# Altium project FlyControl.PrjPCB
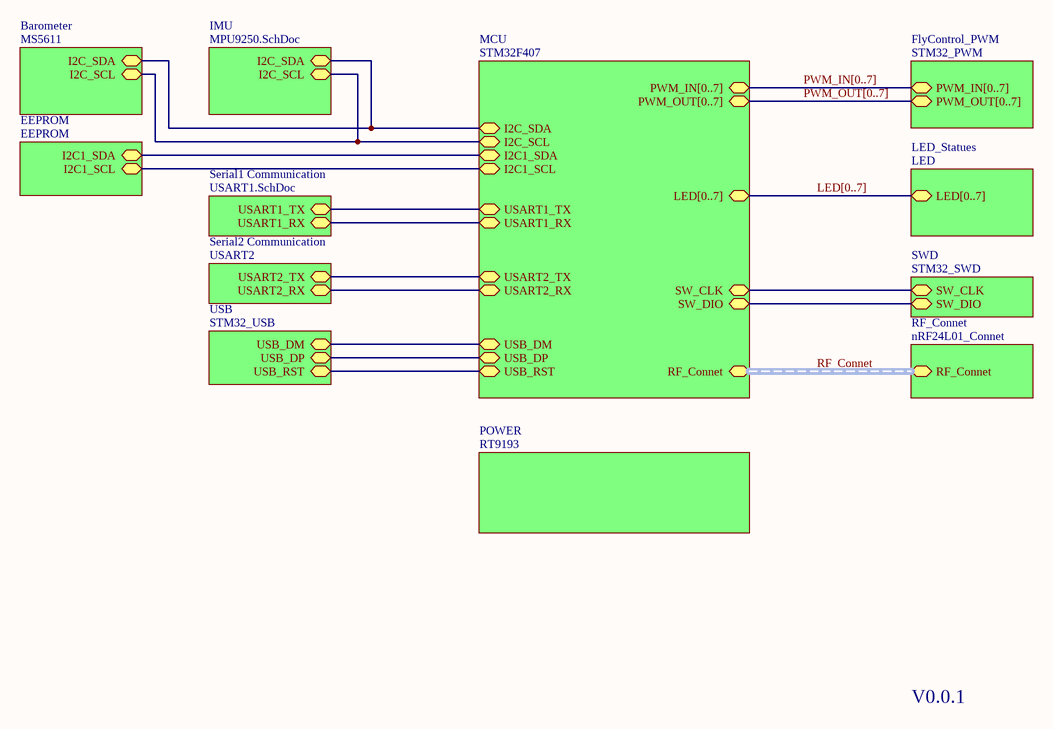
[diagram p0: MAIN.SchDoc]
13 sheets, 74 parts. Net scope: hierarchical (ports join the sheet entries above them; power ports are global).
Board file: FlyControl.PcbDoc
Sheets:
  MAIN.SchDoc
    MCU = STM32F407.SchDoc
    SWD = STM32_SWD.SchDoc
    FlyControl_PWM = STM32_PWM.SchDoc
    IMU = MPU9250.SchDoc
    Barometer = MS5611.SchDoc
    POWER = RT9193.SchDoc
    Serial1 Communication = USART1.SchDoc
    USB = STM32_USB.SchDoc
    Serial2 Communication = USART2.SchDoc
    LED_Statues = LED.SchDoc
    RF_Connet = nRF24L01_Connet.SchDoc
    EEPROM = EEPROM.SchDoc

## Sheet MAIN.SchDoc
size A4

### Sub-sheets
Barometer = MS5611: I2C_SDA, I2C_SCL
EEPROM = EEPROM: I2C1_SDA, I2C1_SCL
FlyControl_PWM = STM32_PWM: PWM_IN[0..7], PWM_OUT[0..7]
IMU = MPU9250.SchDoc: I2C_SDA, I2C_SCL
LED_Statues = LED: LED[0..7]
MCU = STM32F407: PWM_IN[0..7], PWM_OUT[0..7], I2C_SDA, I2C_SCL, LED[0..7], SW_CLK, SW_DIO, USART1_RX, USART1_TX, USART2_RX, USART2_TX, USB_DM, USB_DP, USB_RST, RF_Connet (harness NRF), I2C1_SDA, I2C1_SCL
POWER = RT9193: no entries
RF_Connet = nRF24L01_Connet: RF_Connet (harness NRF)
Serial1 Communication = USART1.SchDoc: USART1_TX, USART1_RX
Serial2 Communication = USART2: USART2_TX, USART2_RX
SWD = STM32_SWD: SW_DIO, SW_CLK
USB = STM32_USB: USB_DM, USB_DP, USB_RST

### Nets
I2C1_SCL: sheet MCU/I2C1_SCL, sheet EEPROM/I2C1_SCL
I2C1_SDA: sheet MCU/I2C1_SDA, sheet EEPROM/I2C1_SDA
I2C_SCL: sheet MCU/I2C_SCL, sheet IMU/I2C_SCL, sheet Barometer/I2C_SCL
I2C_SDA: sheet MCU/I2C_SDA, sheet IMU/I2C_SDA, sheet Barometer/I2C_SDA
SW_CLK: sheet MCU/SW_CLK, sheet SWD/SW_CLK
SW_DIO: sheet MCU/SW_DIO, sheet SWD/SW_DIO
USART1_RX: sheet MCU/USART1_RX, sheet Serial1 Communication/USART1_RX
USART1_TX: sheet MCU/USART1_TX, sheet Serial1 Communication/USART1_TX
USART2_RX: sheet MCU/USART2_RX, sheet Serial2 Communication/USART2_RX
USART2_TX: sheet MCU/USART2_TX, sheet Serial2 Communication/USART2_TX
USB_DM: sheet MCU/USB_DM, sheet USB/USB_DM
USB_DP: sheet MCU/USB_DP, sheet USB/USB_DP
USB_RST: sheet MCU/USB_RST, sheet USB/USB_RST

### Buses and harness runs
bus LED[0..7] = sheet LED_Statues/LED[0..7] = sheet MCU/LED[0..7]
bus PWM_IN[0..7] = sheet FlyControl_PWM/PWM_IN[0..7] = sheet MCU/PWM_IN[0..7]
bus PWM_OUT[0..7] = sheet FlyControl_PWM/PWM_OUT[0..7] = sheet MCU/PWM_OUT[0..7]
harness RF_Connet = sheet MCU/RF_Connet = sheet RF_Connet/RF_Connet

### Notes on the sheet
- V0.0.1

## Sheet STM32F407.SchDoc
size A3
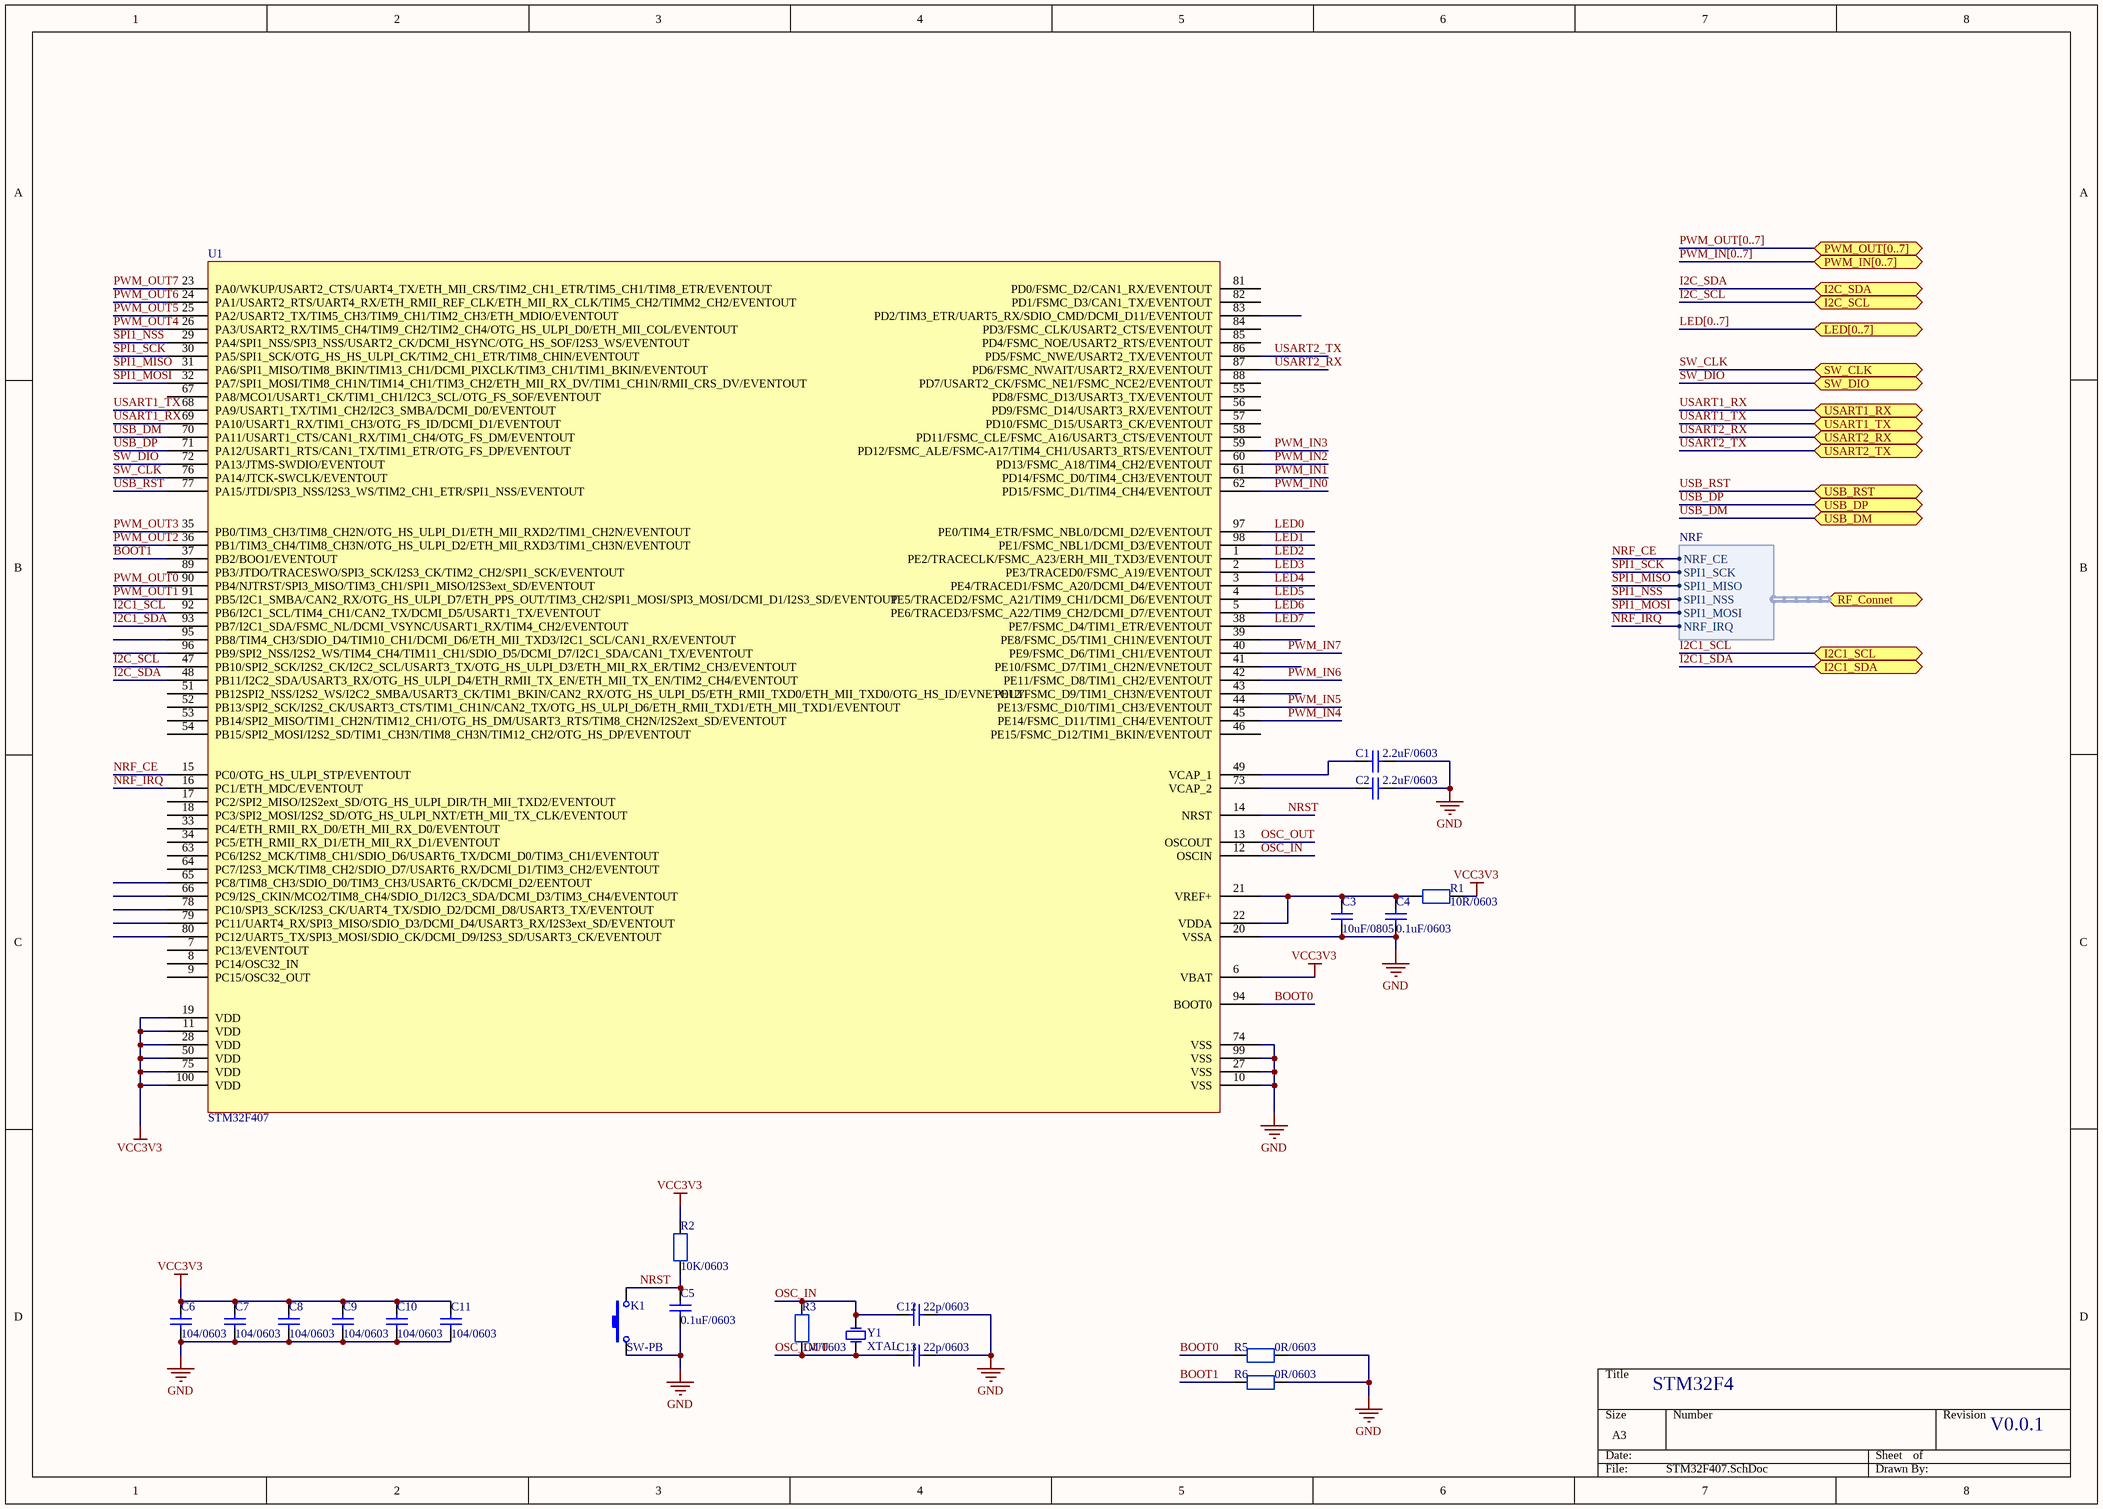
[diagram p1: STM32F407.SchDoc]

### Parts
C1  2.2uF/0603  [C0603]
C2  2.2uF/0603  [C0603]
C3  10uF/0805  [C0805]
C4  0.1uF/0603  [C0603]
C5  0.1uF/0603  [C0603]
C6  104/0603  [C0603]
C7  104/0603  [C0603]
C8  104/0603  [C0603]
C9  104/0603  [C0603]
C10  104/0603  [C0603]
C11  104/0603  [C0603]
C12  22p/0603  [C0603]
C13  22p/0603  [C0603]
K1  SW-PB  [SW-PB-A1]
R1  10R/0603  [R0603]
R2  10K/0603  [R0603]
R3  1M/0603  [R0603]
R5  0R/0603  [R0603]
R6  0R/0603  [R0402]
U1  STM32F407  [LQFP100-N]
Y1  XTAL  [XTAL-3225]

### Ports
I2C1_SCL, I2C1_SDA, I2C_SCL, I2C_SDA, LED[0..7], PWM_IN[0..7], PWM_OUT[0..7], RF_Connet (harness NRF), SW_CLK, SW_DIO, USART1_RX, USART1_TX, USART2_RX, USART2_TX, USB_DM, USB_DP, USB_RST

### Harnesses
NRF: NRF_CE, SPI1_SCK, SPI1_MISO, SPI1_NSS, SPI1_MOSI, NRF_IRQ

### Nets
GND: C1.1 C2.1 C3.1 C4.1 C5.1 C6.1 C7.1 C8.1 C9.1 C10.1 C11.1 C12.1 C13.1 K1.1 R5.2 R6.2 U1.10(VSS) U1.20(VSSA) U1.27(VSS) U1.74(VSS) U1.99(VSS)
VCC3V3: C6.2 C7.2 C8.2 C9.2 C10.2 C11.2 R1.1 R2.2 U1.6(VBAT) U1.11(VDD) U1.19(VDD) U1.28(VDD) U1.50(VDD) U1.75(VDD) U1.100(VDD)
BOOT0: R5.1 U1.94(BOOT0)
BOOT1: R6.1 U1.37(PB2/BOO1/EVENTOUT)
I2C1_SCL: U1.92(PB6/I2C1_SCL/TIM4_CH1/CAN2_TX/DCMI_D5/USART1_TX/EVENTOUT) ; port I2C1_SCL
I2C1_SDA: U1.93(PB7/I2C1_SDA/FSMC_NL/DCMI_VSYNC/USART1_RX/TIM4_CH2/EVENTOUT) ; port I2C1_SDA
I2C_SCL: U1.47(PB10/SPI2_SCK/I2S2_CK/I2C2_SCL/USART3_TX/OTG_HS_ULPI_D3/ETH_MII_RX_ER/TIM2_CH3/EVENTOUT) ; port I2C_SCL
I2C_SDA: U1.48(PB11/I2C2_SDA/USART3_RX/OTG_HS_ULPI_D4/ETH_RMII_TX_EN/ETH_MII_TX_EN/TIM2_CH4/EVENTOUT) ; port I2C_SDA
LED0: U1.97(PE0/TIM4_ETR/FSMC_NBL0/DCMI_D2/EVENTOUT)
LED1: U1.98(PE1/FSMC_NBL1/DCMI_D3/EVENTOUT)
LED2: U1.1(PE2/TRACECLK/FSMC_A23/ERH_MII_TXD3/EVENTOUT)
LED3: U1.2(PE3/TRACED0/FSMC_A19/EVENTOUT)
LED4: U1.3(PE4/TRACED1/FSMC_A20/DCMI_D4/EVENTOUT)
LED5: U1.4(PE5/TRACED2/FSMC_A21/TIM9_CH1/DCMI_D6/EVENTOUT)
LED6: U1.5(PE6/TRACED3/FSMC_A22/TIM9_CH2/DCMI_D7/EVENTOUT)
LED7: U1.38(PE7/FSMC_D4/TIM1_ETR/EVENTOUT)
NRF_CE: U1.15(PC0/OTG_HS_ULPI_STP/EVENTOUT) ; port RF_Connet.NRF_CE
NRF_IRQ: U1.16(PC1/ETH_MDC/EVENTOUT) ; port RF_Connet.NRF_IRQ
NRST: C5.2 K1.2 R2.1 U1.14(NRST)
OSC_IN: C12.2 R3.2 U1.12(OSCIN) Y1.2(OSC2)
OSC_OUT: C13.2 R3.1 U1.13(OSCOUT) Y1.1(OSC1)
PWM_IN0: U1.62(PD15/FSMC_D1/TIM4_CH4/EVENTOUT)
PWM_IN1: U1.61(PD14/FSMC_D0/TIM4_CH3/EVENTOUT)
PWM_IN2: U1.60(PD13/FSMC_A18/TIM4_CH2/EVENTOUT)
PWM_IN3: U1.59(PD12/FSMC_ALE/FSMC-A17/TIM4_CH1/USART3_RTS/EVENTOUT)
PWM_IN4: U1.45(PE14/FSMC_D11/TIM1_CH4/EVENTOUT)
PWM_IN5: U1.44(PE13/FSMC_D10/TIM1_CH3/EVENTOUT)
PWM_IN6: U1.42(PE11/FSMC_D8/TIM1_CH2/EVENTOUT)
PWM_IN7: U1.40(PE9/FSMC_D6/TIM1_CH1/EVENTOUT)
PWM_OUT0: U1.90(PB4/NJTRST/SPI3_MISO/TIM3_CH1/SPI1_MISO/I2S3ext_SD/EVENTOUT)
PWM_OUT1: U1.91(PB5/I2C1_SMBA/CAN2_RX/OTG_HS_ULPI_D7/ETH_PPS_OUT/TIM3_CH2/SPI1_MOSI/SPI3_MOSI/DCMI_D1/I2S3_SD/EVENTOUT)
PWM_OUT2: U1.36(PB1/TIM3_CH4/TIM8_CH3N/OTG_HS_ULPI_D2/ETH_MII_RXD3/TIM1_CH3N/EVENTOUT)
PWM_OUT3: U1.35(PB0/TIM3_CH3/TIM8_CH2N/OTG_HS_ULPI_D1/ETH_MII_RXD2/TIM1_CH2N/EVENTOUT)
PWM_OUT4: U1.26(PA3/USART2_RX/TIM5_CH4/TIM9_CH2/TIM2_CH4/OTG_HS_ULPI_D0/ETH_MII_COL/EVENTOUT)
PWM_OUT5: U1.25(PA2/USART2_TX/TIM5_CH3/TIM9_CH1/TIM2_CH3/ETH_MDIO/EVENTOUT)
PWM_OUT6: U1.24(PA1/USART2_RTS/UART4_RX/ETH_RMII_REF_CLK/ETH_MII_RX_CLK/TIM5_CH2/TIMM2_CH2/EVENTOUT)
PWM_OUT7: U1.23(PA0/WKUP/USART2_CTS/UART4_TX/ETH_MII_CRS/TIM2_CH1_ETR/TIM5_CH1/TIM8_ETR/EVENTOUT)
SPI1_MISO: U1.31(PA6/SPI1_MISO/TIM8_BKIN/TIM13_CH1/DCMI_PIXCLK/TIM3_CH1/TIM1_BKIN/EVENTOUT) ; port RF_Connet.SPI1_MISO  [project net RF_Connet.SPI1_MISO]
SPI1_MOSI: U1.32(PA7/SPI1_MOSI/TIM8_CH1N/TIM14_CH1/TIM3_CH2/ETH_MII_RX_DV/TIM1_CH1N/RMII_CRS_DV/EVENTOUT) ; port RF_Connet.SPI1_MOSI  [project net RF_Connet.SPI1_MOSI]
SPI1_NSS: U1.29(PA4/SPI1_NSS/SPI3_NSS/USART2_CK/DCMI_HSYNC/OTG_HS_SOF/I2S3_WS/EVENTOUT) ; port RF_Connet.SPI1_NSS  [project net RF_Connet.SPI1_NSS]
SPI1_SCK: U1.30(PA5/SPI1_SCK/OTG_HS_HS_ULPI_CK/TIM2_CH1_ETR/TIM8_CHIN/EVENTOUT) ; port RF_Connet.SPI1_SCK  [project net RF_Connet.SPI1_SCK]
SW_CLK: U1.76(PA14/JTCK-SWCLK/EVENTOUT) ; port SW_CLK
SW_DIO: U1.72(PA13/JTMS-SWDIO/EVENTOUT) ; port SW_DIO
USART1_RX: U1.69(PA10/USART1_RX/TIM1_CH3/OTG_FS_ID/DCMI_D1/EVENTOUT) ; port USART1_RX
USART1_TX: U1.68(PA9/USART1_TX/TIM1_CH2/I2C3_SMBA/DCMI_D0/EVENTOUT) ; port USART1_TX
USART2_RX: U1.87(PD6/FSMC_NWAIT/USART2_RX/EVENTOUT) ; port USART2_RX
USART2_TX: U1.86(PD5/FSMC_NWE/USART2_TX/EVENTOUT) ; port USART2_TX
USB_DM: U1.70(PA11/USART1_CTS/CAN1_RX/TIM1_CH4/OTG_FS_DM/EVENTOUT) ; port USB_DM
USB_DP: U1.71(PA12/USART1_RTS/CAN1_TX/TIM1_ETR/OTG_FS_DP/EVENTOUT) ; port USB_DP
USB_RST: U1.77(PA15/JTDI/SPI3_NSS/I2S3_WS/TIM2_CH1_ETR/SPI1_NSS/EVENTOUT) ; port USB_RST
NetC1_2: C1.2 U1.49(VCAP_1)
NetC2_2: C2.2 U1.73(VCAP_2)
NetC3_2: C3.2 C4.2 R1.2 U1.21(VREF+) U1.22(VDDA)

Not connected (* = marked no-connect by the designer): U1 7(PC13/EVENTOUT) 8(PC14/OSC32_IN) 9(PC15/OSC32_OUT) 17(PC2/SPI2_MISO/I2S2ext_SD/OTG_HS_ULPI_DIR/TH_MII_TXD2/EVENTOUT) 18(PC3/SPI2_MOSI/I2S2_SD/OTG_HS_ULPI_NXT/ETH_MII_TX_CLK/EVENTOUT) 33(PC4/ETH_RMII_RX_D0/ETH_MII_RX_D0/EVENTOUT) 34(PC5/ETH_RMII_RX_D1/ETH_MII_RX_D1/EVENTOUT) 39(PE8/FSMC_D5/TIM1_CH1N/EVENTOUT) 41(PE10/FSMC_D7/TIM1_CH2N/EVNETOUT) 43(PE12/FSMC_D9/TIM1_CH3N/EVENTOUT) 46(PE15/FSMC_D12/TIM1_BKIN/EVENTOUT) 51(PB12SPI2_NSS/I2S2_WS/I2C2_SMBA/USART3_CK/TIM1_BKIN/CAN2_RX/OTG_HS_ULPI_D5/ETH_RMII_TXD0/ETH_MII_TXD0/OTG_HS_ID/EVNETOUT) 52(PB13/SPI2_SCK/I2S2_CK/USART3_CTS/TIM1_CH1N/CAN2_TX/OTG_HS_ULPI_D6/ETH_RMII_TXD1/ETH_MII_TXD1/EVENTOUT) 53(PB14/SPI2_MISO/TIM1_CH2N/TIM12_CH1/OTG_HS_DM/USART3_RTS/TIM8_CH2N/I2S2ext_SD/EVENTOUT) 54(PB15/SPI2_MOSI/I2S2_SD/TIM1_CH3N/TIM8_CH3N/TIM12_CH2/OTG_HS_DP/EVENTOUT) 55(PD8/FSMC_D13/USART3_TX/EVENTOUT) 56(PD9/FSMC_D14/USART3_RX/EVENTOUT) 57(PD10/FSMC_D15/USART3_CK/EVENTOUT) 58(PD11/FSMC_CLE/FSMC_A16/USART3_CTS/EVENTOUT) 63(PC6/I2S2_MCK/TIM8_CH1/SDIO_D6/USART6_TX/DCMI_D0/TIM3_CH1/EVENTOUT) 64(PC7/I2S3_MCK/TIM8_CH2/SDIO_D7/USART6_RX/DCMI_D1/TIM3_CH2/EVENTOUT) 65(PC8/TIM8_CH3/SDIO_D0/TIM3_CH3/USART6_CK/DCMI_D2/EENTOUT) 66(PC9/I2S_CKIN/MCO2/TIM8_CH4/SDIO_D1/I2C3_SDA/DCMI_D3/TIM3_CH4/EVENTOUT) 67(PA8/MCO1/USART1_CK/TIM1_CH1/I2C3_SCL/OTG_FS_SOF/EVENTOUT) 78(PC10/SPI3_SCK/I2S3_CK/UART4_TX/SDIO_D2/DCMI_D8/USART3_TX/EVENTOUT) 79(PC11/UART4_RX/SPI3_MISO/SDIO_D3/DCMI_D4/USART3_RX/I2S3ext_SD/EVENTOUT) 80(PC12/UART5_TX/SPI3_MOSI/SDIO_CK/DCMI_D9/I2S3_SD/USART3_CK/EVENTOUT) 81(PD0/FSMC_D2/CAN1_RX/EVENTOUT) 82(PD1/FSMC_D3/CAN1_TX/EVENTOUT) 83(PD2/TIM3_ETR/UART5_RX/SDIO_CMD/DCMI_D11/EVENTOUT) 84(PD3/FSMC_CLK/USART2_CTS/EVENTOUT) 85(PD4/FSMC_NOE/USART2_RTS/EVENTOUT) 88(PD7/USART2_CK/FSMC_NE1/FSMC_NCE2/EVENTOUT) 89(PB3/JTDO/TRACESWO/SPI3_SCK/I2S3_CK/TIM2_CH2/SPI1_SCK/EVENTOUT) 95(PB8/TIM4_CH3/SDIO_D4/TIM10_CH1/DCMI_D6/ETH_MII_TXD3/I2C1_SCL/CAN1_RX/EVENTOUT) 96(PB9/SPI2_NSS/I2S2_WS/TIM4_CH4/TIM11_CH1/SDIO_D5/DCMI_D7/I2C1_SDA/CAN1_TX/EVENTOUT)

### Buses and harness runs
bus LED[0..7] = port LED[0..7]
bus PWM_IN[0..7] = port PWM_IN[0..7]
bus PWM_OUT[0..7] = port PWM_OUT[0..7]

### Notes on the sheet
- STM32F4
- V0.0.1

### Library data of the parts
C1-C13 = CAP: 无极性贴片电容
R1-R3 R5 R6 = RES
U1 = STM32F4: STM32F407VGT6

## Sheet STM32_SWD.SchDoc
size A4
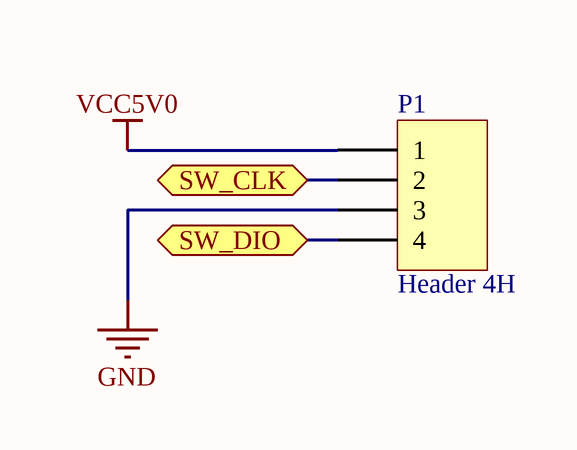
[diagram p2: STM32_SWD.SchDoc]

### Parts
P1  Header 4H  [HDR1X4H]

### Ports
SW_CLK, SW_DIO

### Nets
GND: P1.3
VCC5V0: P1.1
SW_CLK: P1.2 ; port SW_CLK
SW_DIO: P1.4 ; port SW_DIO

### Library data of the parts
P1 = Header 4H: Header, 4-Pin, Right Angle; LatestRevisionDate: 17-Jul-2002; LatestRevisionNote: Re-released for DXP Platform.; Publisher: Altium Limited

## Sheet STM32_PWM.SchDoc
size A4
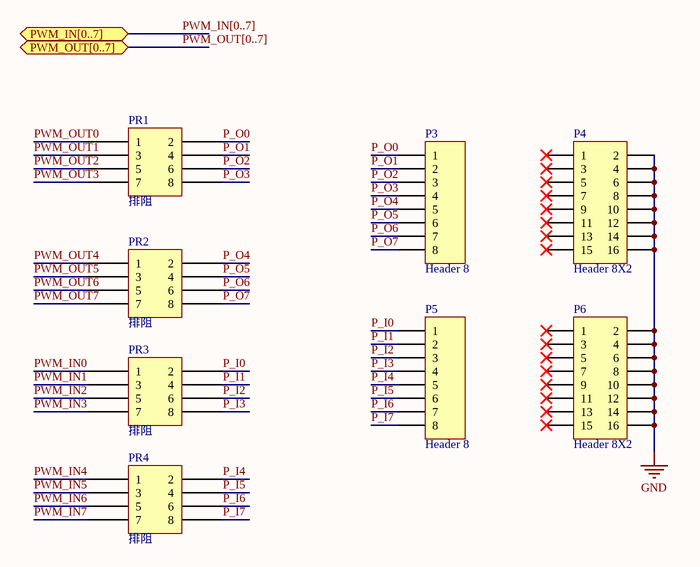
[diagram p3: STM32_PWM.SchDoc]

### Parts
P3  Header 8  [HDR1X8]
P4  Header 8X2  [HDR2X8]
P5  Header 8  [HDR1X8]
P6  Header 8X2  [HDR2X8]
PR1  排阻  [8P4R-0603]
PR2  排阻  [8P4R-0603]
PR3  排阻  [8P4R-0603]
PR4  排阻  [8P4R-0603]

### Ports
PWM_IN[0..7], PWM_OUT[0..7]

### Nets
GND: P4.2 P4.4 P4.6 P4.8 P4.10 P4.12 P4.14 P4.16 P6.2 P6.4 P6.6 P6.8 P6.10 P6.12 P6.14 P6.16
P_I0: P5.1 PR3.2
P_I1: P5.2 PR3.4
P_I2: P5.3 PR3.6
P_I3: P5.4 PR3.8
P_I4: P5.5 PR4.2
P_I5: P5.6 PR4.4
P_I6: P5.7 PR4.6
P_I7: P5.8 PR4.8
P_O0: P3.1 PR1.2
P_O1: P3.2 PR1.4
P_O2: P3.3 PR1.6
P_O3: P3.4 PR1.8
P_O4: P3.5 PR2.2
P_O5: P3.6 PR2.4
P_O6: P3.7 PR2.6
P_O7: P3.8 PR2.8
PWM_IN0: PR3.1
PWM_IN1: PR3.3
PWM_IN2: PR3.5
PWM_IN3: PR3.7
PWM_IN4: PR4.1
PWM_IN5: PR4.3
PWM_IN6: PR4.5
PWM_IN7: PR4.7
PWM_OUT0: PR1.1
PWM_OUT1: PR1.3
PWM_OUT2: PR1.5
PWM_OUT3: PR1.7
PWM_OUT4: PR2.1
PWM_OUT5: PR2.3
PWM_OUT6: PR2.5
PWM_OUT7: PR2.7

Not connected (* = marked no-connect by the designer): P4 1* 3* 5* 7* 9* 11* 13* 15*; P6 1* 3* 5* 7* 9* 11* 13* 15*

### Buses and harness runs
bus PWM_IN[0..7] = port PWM_IN[0..7]
bus PWM_OUT[0..7] = port PWM_OUT[0..7]

### Library data of the parts
P3 P5 = Header 8: Header, 8-Pin; LatestRevisionDate: 17-Jul-2002; LatestRevisionNote: Re-released for DXP Platform.; Publisher: Altium Limited
P4 P6 = Header 8X2: Header, 8-Pin, Dual row; LatestRevisionDate: 17-Jul-2002; LatestRevisionNote: Re-released for DXP Platform.; Publisher: Altium Limited
PR1-PR4 = RES*4

## Sheet MPU9250.SchDoc
size A4
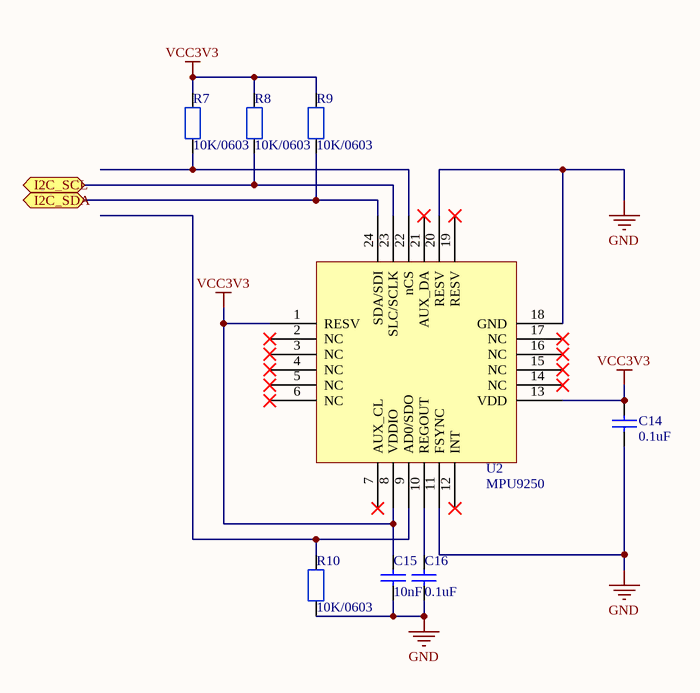
[diagram p4: MPU9250.SchDoc]

### Parts
C14  0.1uF  [C0603]
C15  10nF  [C0603]
C16  0.1uF  [C0603]
R7  10K/0603  [R0603]
R8  10K/0603  [R0603]
R9  10K/0603  [R0603]
R10  10K/0603  [R0603]
U2  MPU9250  [QFN24]

### Ports
I2C_SCL, I2C_SDA

### Nets
GND: C14.1 C15.1 C16.1 R10.1 U2.11(FSYNC) U2.18(GND) U2.20(RESV)
VCC3V3: C14.2 C15.2 R7.2 R8.2 R9.2 U2.1(RESV) U2.8(VDDIO) U2.13(VDD)
I2C_SCL: R8.1 U2.23(SLC/SCLK) ; port I2C_SCL
I2C_SDA: R9.1 U2.24(SDA/SDI) ; port I2C_SDA
NetC16_2: C16.2 U2.10(REGOUT)
NetR7_1: R7.1 U2.22(nCS)
NetR10_2: R10.2 U2.9(AD0/SDO)

Not connected (* = marked no-connect by the designer): U2 2(NC)* 3(NC)* 4(NC)* 5(NC)* 6(NC)* 7(AUX_CL)* 12(INT)* 14(NC)* 15(NC)* 16(NC)* 17(NC)* 19(RESV)* 21(AUX_DA)*

### Library data of the parts
C14-C16 = CAP: 无极性贴片电容
R7-R10 = RES

## Sheet MS5611.SchDoc
size A4
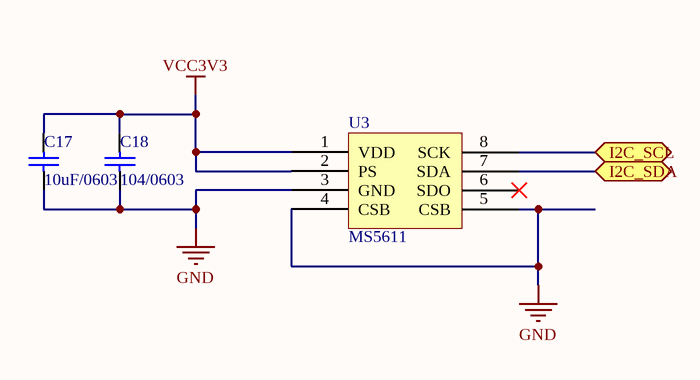
[diagram p5: MS5611.SchDoc]

### Parts
C17  10uF/0603  [C0603]
C18  104/0603  [C0603]
U3  MS5611  [MS5611]

### Ports
I2C_SCL, I2C_SDA

### Nets
GND: C17.1 C18.1 U3.3(GND) U3.4(CSB) U3.5(CSB)
VCC3V3: C17.2 C18.2 U3.1(VDD) U3.2(PS)
I2C_SCL: U3.8(SCK) ; port I2C_SCL
I2C_SDA: U3.7(SDA) ; port I2C_SDA

Not connected (* = marked no-connect by the designer): U3 6(SDO)*

### Library data of the parts
C17 C18 = CAP: 无极性贴片电容
U3 = MS5611: barometer

## Sheet RT9193.SchDoc
size A4
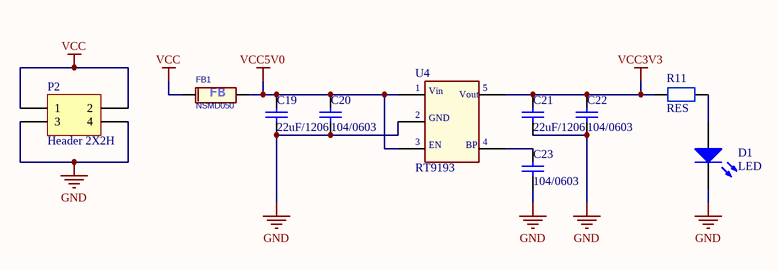
[diagram p6: RT9193.SchDoc]

### Parts
C19  22uF/1206  [C1206]
C20  104/0603  [C1206]
C21  22uF/1206  [C1206]
C22  104/0603  [C1206]
C23  104/0603  [C1206]
D1  LED  [LED0805]
FB1  NSMD050  [R1206]
P2  Header 2X2H  [HDR2X2H]
R11  RES  [R0603]
U4  RT9193  [SOT-23-5]

### Nets
GND: C19.1 C20.1 C21.1 C22.1 C23.1 D1.1(K) P2.3 P2.4 U4.2(GND)
VCC: FB1.1 P2.1 P2.2
VCC3V3: C21.2 C22.2 R11.2 U4.5(Vout)
VCC5V0: C19.2 C20.2 FB1.2 U4.1(Vin) U4.3(SHDN)
NetC23_2: C23.2 U4.4(BP)
NetD1_2: D1.2(A) R11.1

### Notes on the sheet
- (in symbol RT9193) EN

### Library data of the parts
C19-C23 = CAP: 无极性贴片电容
FB1 = FB: Ferrite Beads Inductors Impedance:120Ω±25% Rated Current:1500mA DC Resistance:0.095Ω; Manufacturer: muRata; Manufacturer Part Number: BLM15EG121SN1
P2 = Header 2X2H: Header, 2-Pin, Dual row, Right Angle; LatestRevisionDate: 17-Jul-2002; LatestRevisionNote: Re-released for DXP Platform.; Publisher: Altium Limited
U4 = RT9193: RT9193-1.2, RT9193-1.8, RT9193-3.3

## Sheet USART1.SchDoc
size A4
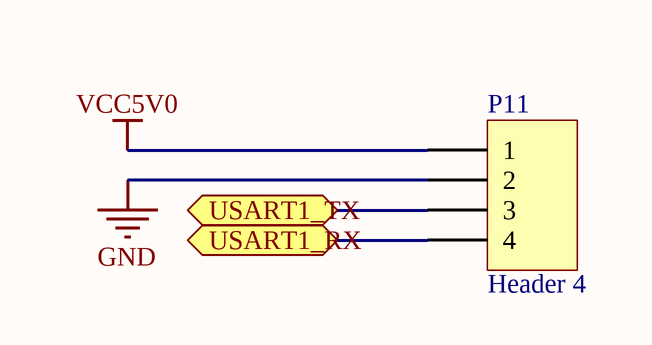
[diagram p7: USART1.SchDoc]

### Parts
P11  Header 4  [HDR1X4]

### Ports
USART1_RX, USART1_TX

### Nets
GND: P11.2
VCC5V0: P11.1
USART1_RX: P11.4 ; port USART1_RX
USART1_TX: P11.3 ; port USART1_TX

### Library data of the parts
P11 = Header 4: Header, 4-Pin; LatestRevisionDate: 17-Jul-2002; LatestRevisionNote: Re-released for DXP Platform.; Publisher: Altium Limited

## Sheet STM32_USB.SchDoc
size A4
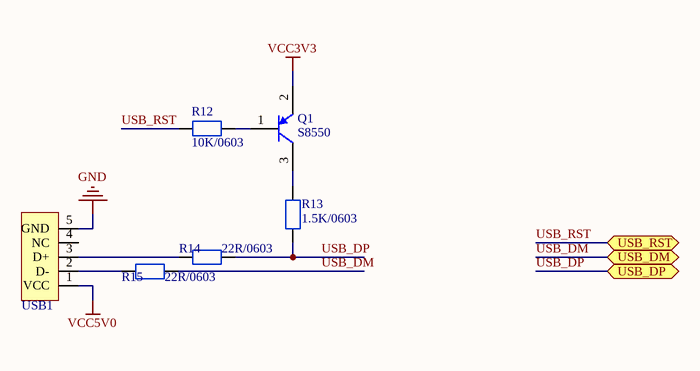
[diagram p8: STM32_USB.SchDoc]

### Parts
Q1  S8550  [SOT-23]
R12  10K/0603  [R0603]
R13  1.5K/0603  [R0603]
R14  22R/0603  [R0603]
R15  22R/0603  [R0603]
USB1  USB-Mini  [USB-Mini]  (value not drawn)

### Ports
USB_DM, USB_DP, USB_RST

### Nets
GND: USB1.5(GND)
VCC3V3: Q1.2(E)
VCC5V0: USB1.1(VCC)
USB_DM: R15.2 ; port USB_DM
USB_DP: R13.1 R14.2 ; port USB_DP
USB_RST: R12.2 ; port USB_RST
NetQ1_1: Q1.1(B) R12.1
NetQ1_3: Q1.3(C) R13.2
NetR14_1: R14.1 USB1.3(D+)
NetR15_1: R15.1 USB1.2(D-)

Not connected (* = marked no-connect by the designer): USB1 4(NC)

### Library data of the parts
R12-R15 = RES

## Sheet USART2.SchDoc
size A4
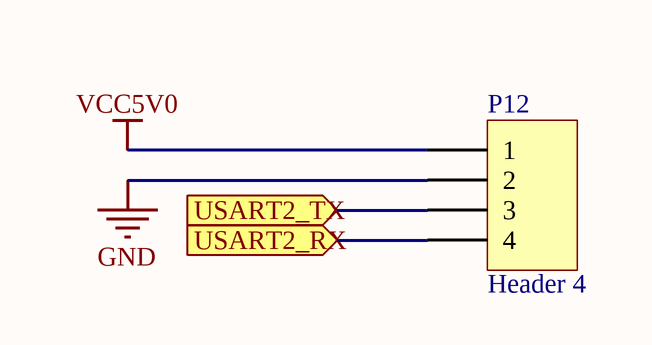
[diagram p9: USART2.SchDoc]

### Parts
P12  Header 4  [HDR1X4]

### Ports
USART2_RX, USART2_TX

### Nets
GND: P12.2
VCC5V0: P12.1
USART2_RX: P12.4 ; port USART2_RX
USART2_TX: P12.3 ; port USART2_TX

### Library data of the parts
P12 = Header 4: Header, 4-Pin; LatestRevisionDate: 17-Jul-2002; LatestRevisionNote: Re-released for DXP Platform.; Publisher: Altium Limited

## Sheet LED.SchDoc
size A4
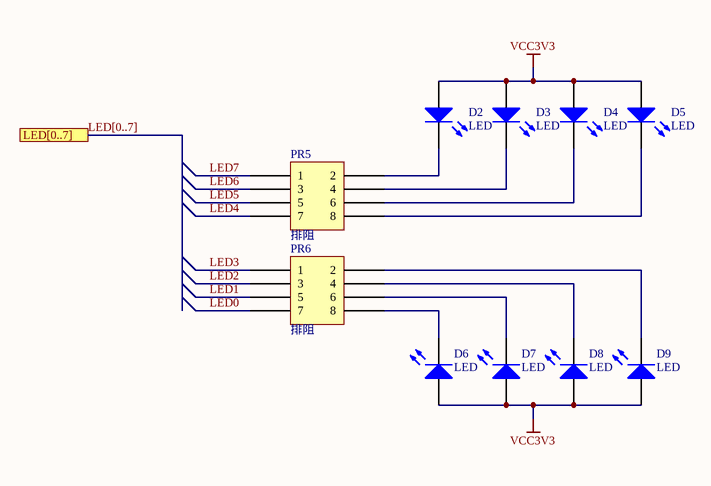
[diagram p10: LED.SchDoc]

### Parts
D2  LED  [LED0805]
D3  LED  [LED0805]
D4  LED  [LED0805]
D5  LED  [LED0805]
D6  LED  [LED0805]
D7  LED  [LED0805]
D8  LED  [LED0805]
D9  LED  [LED0805]
PR5  排阻  [8P4R-0603]
PR6  排阻  [8P4R-0603]

### Ports
LED[0..7]

### Nets
VCC3V3: D2.2(A) D3.2(A) D4.2(A) D5.2(A) D6.2(A) D7.2(A) D8.2(A) D9.2(A)
LED0: PR6.7
LED1: PR6.5
LED2: PR6.3
LED3: PR6.1
LED4: PR5.7
LED5: PR5.5
LED6: PR5.3
LED7: PR5.1
NetD2_1: D2.1(K) PR5.2
NetD3_1: D3.1(K) PR5.4
NetD4_1: D4.1(K) PR5.6
NetD5_1: D5.1(K) PR5.8
NetD6_1: D6.1(K) PR6.8
NetD7_1: D7.1(K) PR6.6
NetD8_1: D8.1(K) PR6.4
NetD9_1: D9.1(K) PR6.2

### Buses and harness runs
bus LED[0..7] = port LED[0..7]

### Library data of the parts
PR5 PR6 = RES*4

## Sheet nRF24L01_Connet.SchDoc
size A4
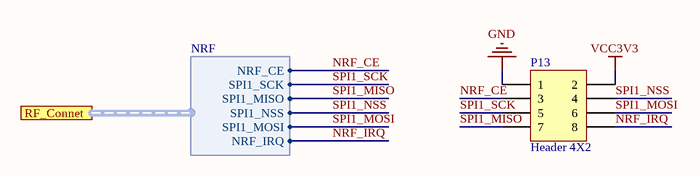
[diagram p11: nRF24L01_Connet.SchDoc]

### Parts
P13  Header 4X2  [HDR2X4]

### Ports
RF_Connet (harness NRF)

### Harnesses
NRF: NRF_CE, SPI1_SCK, SPI1_MISO, SPI1_NSS, SPI1_MOSI, NRF_IRQ

### Nets
GND: P13.1
VCC3V3: P13.2
NRF_CE: P13.3 ; port RF_Connet.NRF_CE
NRF_IRQ: P13.8 ; port RF_Connet.NRF_IRQ
SPI1_MISO: P13.7 ; port RF_Connet.SPI1_MISO  [project net RF_Connet.SPI1_MISO]
SPI1_MOSI: P13.6 ; port RF_Connet.SPI1_MOSI  [project net RF_Connet.SPI1_MOSI]
SPI1_NSS: P13.4 ; port RF_Connet.SPI1_NSS  [project net RF_Connet.SPI1_NSS]
SPI1_SCK: P13.5 ; port RF_Connet.SPI1_SCK  [project net RF_Connet.SPI1_SCK]

### Library data of the parts
P13 = Header 4X2: Header, 4-Pin, Dual row; LatestRevisionDate: 17-Jul-2002; LatestRevisionNote: Re-released for DXP Platform.; Publisher: Altium Limited

## Sheet EEPROM.SchDoc
size A4
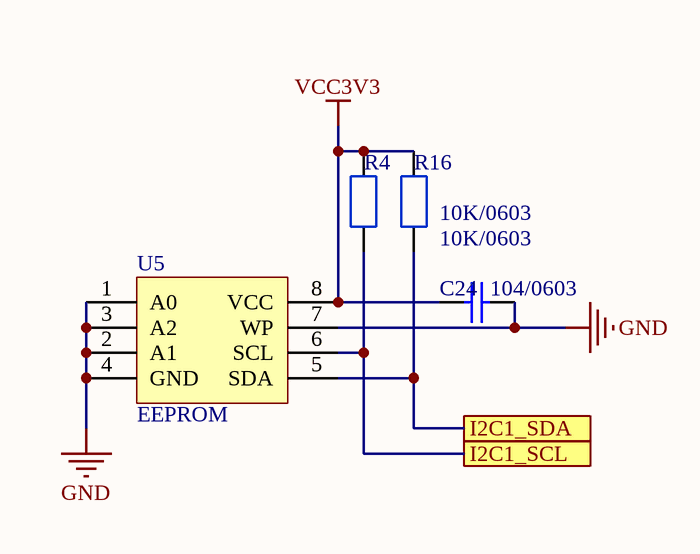
[diagram p12: EEPROM.SchDoc]

### Parts
C24  104/0603  [C0603]
R4  10K/0603  [R0603]
R16  10K/0603  [R0603]
U5  EEPROM  [SOP8]

### Ports
I2C1_SCL, I2C1_SDA

### Nets
GND: C24.2 U5.1(A0) U5.2(A1) U5.3(A2) U5.4(GND) U5.7(WP)
VCC3V3: C24.1 R4.2 R16.2 U5.8(VCC)
I2C1_SCL: R4.1 U5.6(SCL) ; port I2C1_SCL
I2C1_SDA: R16.1 U5.5(SDA) ; port I2C1_SDA

### Library data of the parts
C24 = CAP: 无极性贴片电容
R4 R16 = RES
U5 = 24CXX

## Nets that join several sheets
GND: STM32F407 (21 pins), STM32_SWD (P1.3), STM32_PWM (16 pins), MPU9250 (7 pins), MS5611 (5 pins), RT9193 (9 pins), USART1 (P11.2), STM32_USB (USB1.5), USART2 (P12.2), nRF24L01_Connet (P13.1), EEPROM (6 pins)
VCC3V3: STM32F407 (15 pins), MPU9250 (8 pins), MS5611 (C17.2 C18.2 U3.1 U3.2), RT9193 (C21.2 C22.2 R11.2 U4.5), STM32_USB (Q1.2), LED (8 pins), nRF24L01_Connet (P13.2), EEPROM (C24.1 R4.2 R16.2 U5.8)
VCC5V0: STM32_SWD (P1.1), RT9193 (5 pins), USART1 (P11.1), STM32_USB (USB1.1), USART2 (P12.1)
I2C1_SCL: STM32F407 (U1.92), EEPROM (R4.1 U5.6)
I2C1_SDA: STM32F407 (U1.93), EEPROM (R16.1 U5.5)
I2C_SCL: STM32F407 (U1.47), MPU9250 (R8.1 U2.23), MS5611 (U3.8)
I2C_SDA: STM32F407 (U1.48), MPU9250 (R9.1 U2.24), MS5611 (U3.7)
LED0: STM32F407 (U1.97), LED (PR6.7)
LED1: STM32F407 (U1.98), LED (PR6.5)
LED2: STM32F407 (U1.1), LED (PR6.3)
LED3: STM32F407 (U1.2), LED (PR6.1)
LED4: STM32F407 (U1.3), LED (PR5.7)
LED5: STM32F407 (U1.4), LED (PR5.5)
LED6: STM32F407 (U1.5), LED (PR5.3)
LED7: STM32F407 (U1.38), LED (PR5.1)
NRF_CE: STM32F407 (U1.15), nRF24L01_Connet (P13.3)
NRF_IRQ: STM32F407 (U1.16), nRF24L01_Connet (P13.8)
PWM_IN0: STM32F407 (U1.62), STM32_PWM (PR3.1)
PWM_IN1: STM32F407 (U1.61), STM32_PWM (PR3.3)
PWM_IN2: STM32F407 (U1.60), STM32_PWM (PR3.5)
PWM_IN3: STM32F407 (U1.59), STM32_PWM (PR3.7)
PWM_IN4: STM32F407 (U1.45), STM32_PWM (PR4.1)
PWM_IN5: STM32F407 (U1.44), STM32_PWM (PR4.3)
PWM_IN6: STM32F407 (U1.42), STM32_PWM (PR4.5)
PWM_IN7: STM32F407 (U1.40), STM32_PWM (PR4.7)
PWM_OUT0: STM32F407 (U1.90), STM32_PWM (PR1.1)
PWM_OUT1: STM32F407 (U1.91), STM32_PWM (PR1.3)
PWM_OUT2: STM32F407 (U1.36), STM32_PWM (PR1.5)
PWM_OUT3: STM32F407 (U1.35), STM32_PWM (PR1.7)
PWM_OUT4: STM32F407 (U1.26), STM32_PWM (PR2.1)
PWM_OUT5: STM32F407 (U1.25), STM32_PWM (PR2.3)
PWM_OUT6: STM32F407 (U1.24), STM32_PWM (PR2.5)
PWM_OUT7: STM32F407 (U1.23), STM32_PWM (PR2.7)
RF_Connet.SPI1_MISO: STM32F407 (U1.31), nRF24L01_Connet (P13.7)
RF_Connet.SPI1_MOSI: STM32F407 (U1.32), nRF24L01_Connet (P13.6)
RF_Connet.SPI1_NSS: STM32F407 (U1.29), nRF24L01_Connet (P13.4)
RF_Connet.SPI1_SCK: STM32F407 (U1.30), nRF24L01_Connet (P13.5)
SW_CLK: STM32F407 (U1.76), STM32_SWD (P1.2)
SW_DIO: STM32F407 (U1.72), STM32_SWD (P1.4)
USART1_RX: STM32F407 (U1.69), USART1 (P11.4)
USART1_TX: STM32F407 (U1.68), USART1 (P11.3)
USART2_RX: STM32F407 (U1.87), USART2 (P12.4)
USART2_TX: STM32F407 (U1.86), USART2 (P12.3)
USB_DM: STM32F407 (U1.70), STM32_USB (R15.2)
USB_DP: STM32F407 (U1.71), STM32_USB (R13.1 R14.2)
USB_RST: STM32F407 (U1.77), STM32_USB (R12.2)